# EAGLE design cpld_EPM3256_v3 (EAGLE 9.6.2)
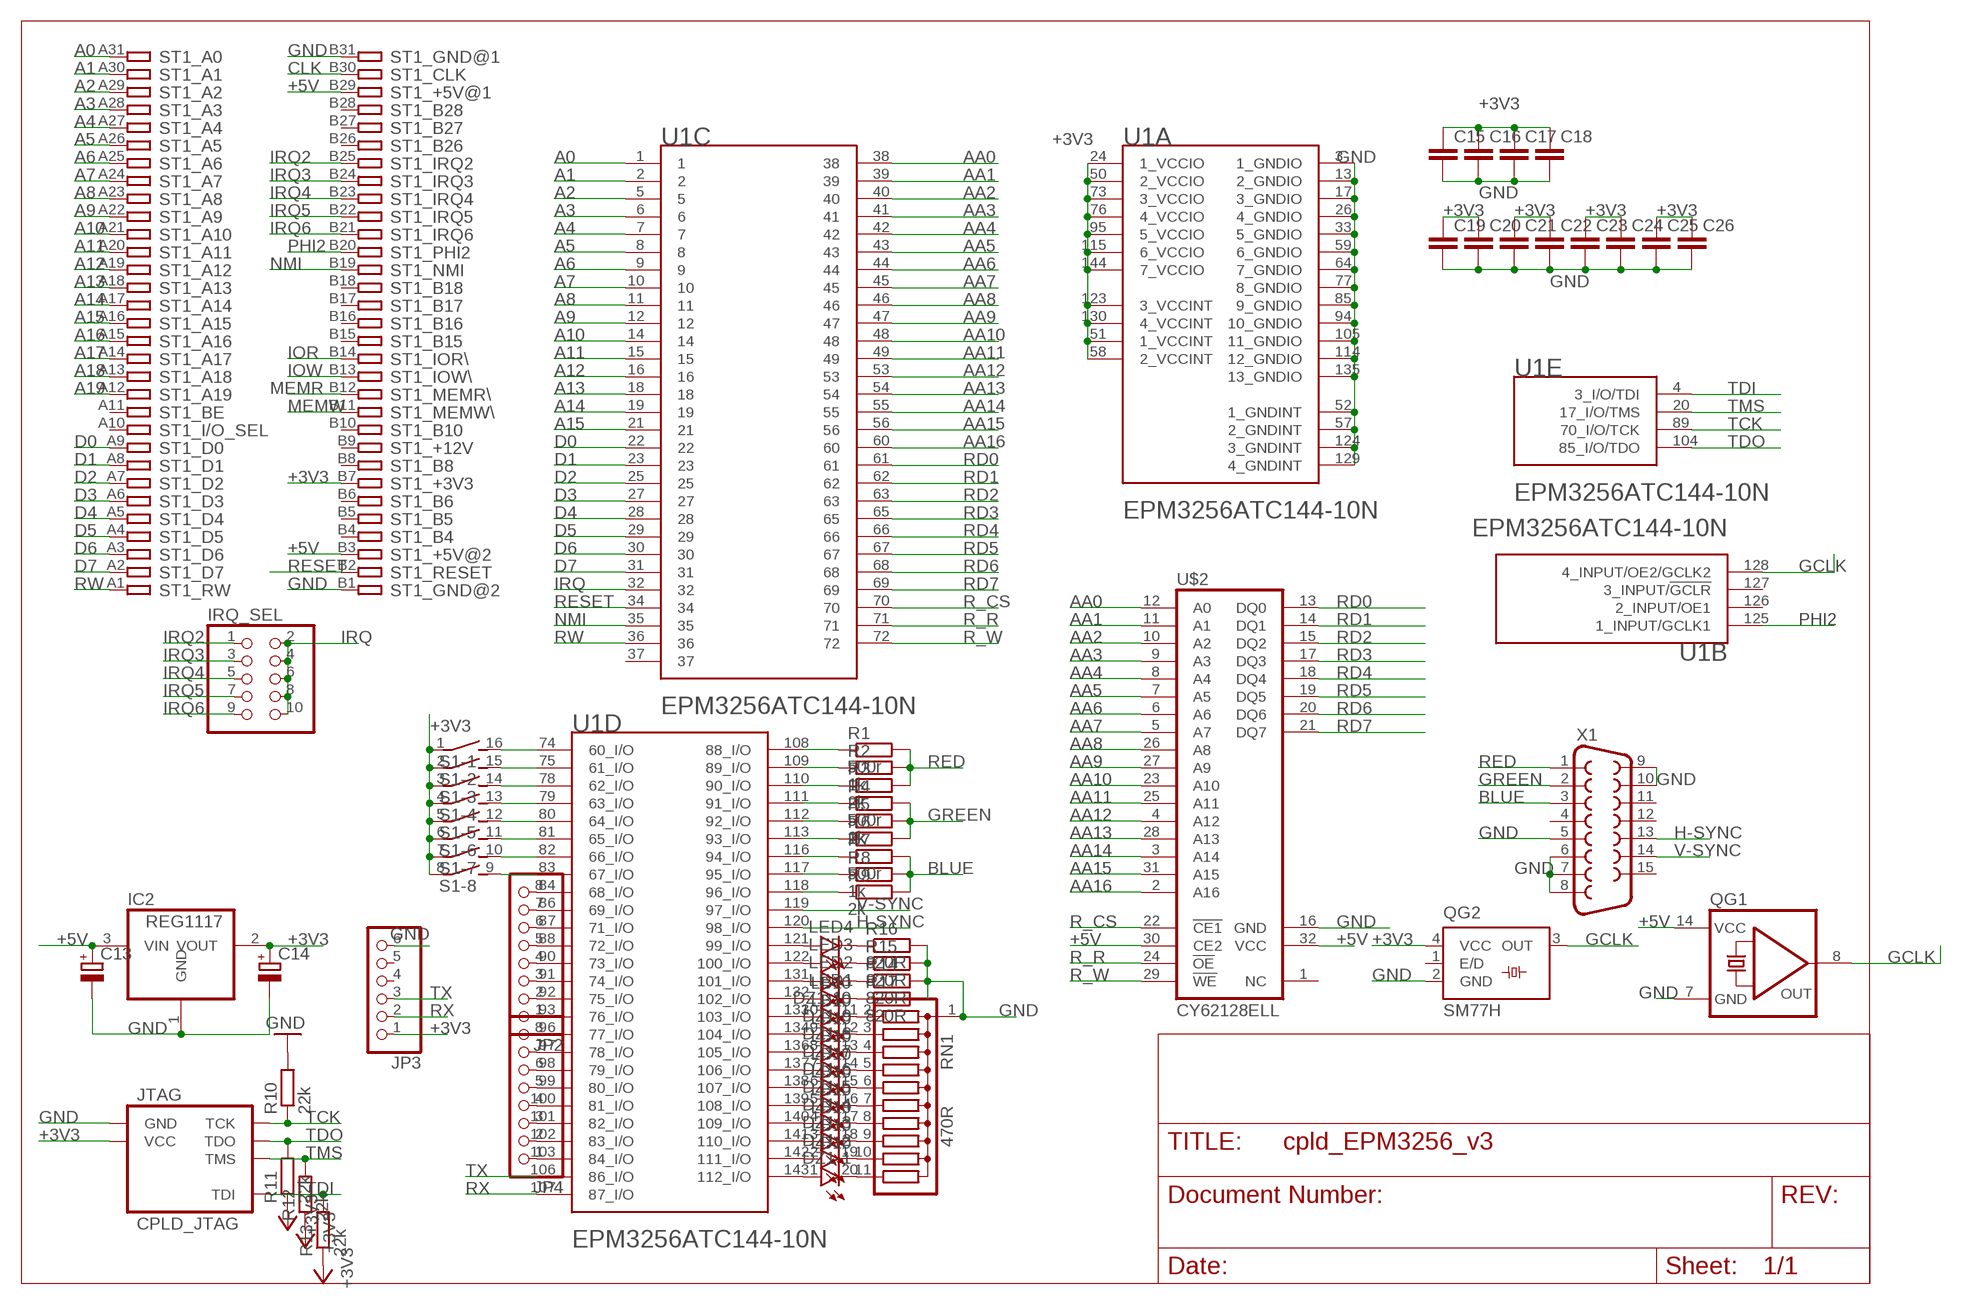
[diagram p0: schematic, sheet 1]

## Parts
C13  CPOL-EUE2.5-5  [E2,5-5]
C14  CPOL-EUE2.5-5  [E2,5-5]
C15  C-EU050-035X075  [C050-035X075]
C16  C-EU050-035X075  [C050-035X075]
C17  C-EU050-035X075  [C050-035X075]
C18  C-EU050-035X075  [C050-035X075]
C19  C-EU050-035X075  [C050-035X075]
C20  C-EU050-035X075  [C050-035X075]
C21  C-EU050-035X075  [C050-035X075]
C22  C-EU050-035X075  [C050-035X075]
C23  C-EU050-035X075  [C050-035X075]
C24  C-EU050-035X075  [C050-035X075]
C25  C-EU050-035X075  [C050-035X075]
C26  C-EU050-035X075  [C050-035X075]
DZ1  LB10  [LB10]
IC2  REG1117  [SOT223]
IRQ_SEL  PINHD-2X5  [2X05]
JP2  PINHD-1X8  [1X08]
JP3  PINHD-1X6/90  [1X06/90]
JP4  PINHD-1X8  [1X08]
JTAG  CPLD_JTAG  [2X05]
LED1  LED3MM  [LED3MM]
LED2  LED3MM  [LED3MM]
LED3  LED3MM  [LED3MM]
LED4  LED3MM  [LED3MM]
QG1  QG5860  [DIL14S]
QG2  SM77H  [SM77H]
R1  500r  R-EU_0204/2V  [0204V]
R2  1k  R-EU_0204/2V  [0204V]
R3  2k  R-EU_0204/2V  [0204V]
R4  500r  R-EU_0204/2V  [0204V]
R5  1k  R-EU_0204/2V  [0204V]
R6  2k  R-EU_0204/2V  [0204V]
R7  500r  R-EU_0204/2V  [0204V]
R8  1k  R-EU_0204/2V  [0204V]
R9  2k  R-EU_0204/2V  [0204V]
R10  22k  R-EU_0207/7  [0207/7]
R11  22k  R-EU_0207/7  [0207/7]
R12  22k  R-EU_0207/7  [0207/7]
R13  22k  R-EU_0207/7  [0207/7]
R14  820R  R-EU_0207/2V  [0207/2V]
R15  820R  R-EU_0207/2V  [0207/2V]
R16  820R  R-EU_0207/2V  [0207/2V]
R17  820R  R-EU_0207/2V  [0207/2V]
RN1  470R  G10R  [SIL11]
S1  DIP08S  [DIP08S]
ST1  IBM8BIT_ISA  [IBM8BIT]
U1  EPM3256ATC144  [TQFP144-BB]
U$2  CY62128ELL  [SOIC32]
X1  F15HDH  [HDF15H]

## Nets
74: S1.16 U1.74(D:60_I/O)
75: S1.15 U1.75(D:61_I/O)
78: S1.14 U1.78(D:62_I/O)
79: S1.13 U1.79(D:63_I/O)
80: S1.12 U1.80(D:64_I/O)
81: S1.11 U1.81(D:65_I/O)
82: S1.10 U1.82(D:66_I/O)
83: S1.9 U1.83(D:67_I/O)
84: JP2.8 U1.84(D:68_I/O)
86: JP2.7 U1.86(D:69_I/O)
87: JP2.6 U1.87(D:71_I/O)
88: JP2.5 U1.88(D:72_I/O)
90: JP2.4 U1.90(D:73_I/O)
91: JP2.3 U1.91(D:74_I/O)
92: JP2.2 U1.92(D:75_I/O)
93: JP2.1 U1.93(D:76_I/O)
96: JP4.8 U1.96(D:77_I/O)
97: JP4.7 U1.97(D:78_I/O)
98: JP4.6 U1.98(D:79_I/O)
99: JP4.5 U1.99(D:80_I/O)
100: JP4.4 U1.100(D:81_I/O)
101: JP4.3 U1.101(D:82_I/O)
102: JP4.2 U1.102(D:83_I/O)
103: JP4.1 U1.103(D:84_I/O)
121: LED4.A U1.121(D:99_I/O)
122: LED3.A U1.122(D:100_I/O)
131: LED2.A U1.131(D:101_I/O)
132: LED1.A U1.132(D:102_I/O)
133: DZ1.10(-10:A) U1.133(D:103_I/O)
134: DZ1.9(-9:A) U1.134(D:104_I/O)
136: DZ1.8(-8:A) U1.136(D:105_I/O)
137: DZ1.7(-7:A) U1.137(D:106_I/O)
138: DZ1.6(-6:A) U1.138(D:107_I/O)
139: DZ1.5(-5:A) U1.139(D:108_I/O)
140: DZ1.4(-4:A) U1.140(D:109_I/O)
141: DZ1.3(-3:A) U1.141(D:110_I/O)
142: DZ1.2(-2:A) U1.142(D:111_I/O)
143: DZ1.1(-1:A) U1.143(D:112_I/O)
+3V3: C14.+ C15.1 C16.1 C17.1 C18.1 C19.1 C20.1 C21.1 C22.1 C23.1 C24.1 C25.1 C26.1 IC2.2(VOUT) JP3.1 JTAG.4(VCC) QG2.4(VCC) R11.1 R12.1 R13.1 S1.1 S1.2 S1.3 S1.4 S1.5 S1.6 S1.7 S1.8 ST1.B7 U1.24(A:1_VCCIO) U1.50(A:2_VCCIO) U1.51(A:1_VCCINT) U1.58(A:2_VCCINT) U1.73(A:3_VCCIO) U1.76(A:4_VCCIO) U1.95(A:5_VCCIO) U1.115(A:6_VCCIO) U1.123(A:3_VCCINT) U1.130(A:4_VCCINT) U1.144(A:7_VCCIO)
+5V: C13.+ IC2.3(VIN) QG1.14(VCC) ST1.B3 ST1.B29 U$2.30(CE2) U$2.32(VCC)
A0: ST1.A31 U1.1
A1: ST1.A30 U1.2
A2: ST1.A29 U1.5
A3: ST1.A28 U1.6
A4: ST1.A27 U1.7
A5: ST1.A26 U1.8
A6: ST1.A25 U1.9
A7: ST1.A24 U1.10
A8: ST1.A23 U1.11
A9: ST1.A22 U1.12
A10: ST1.A21 U1.14
A11: ST1.A20 U1.15
A12: ST1.A19 U1.16
A13: ST1.A18 U1.18
A14: ST1.A17 U1.19
A15: ST1.A16 U1.21
A16: ST1.A15
A17: ST1.A14
A18: ST1.A13
A19: ST1.A12
AA0: U1.38 U$2.12(A0)
AA1: U1.39 U$2.11(A1)
AA2: U1.40 U$2.10(A2)
AA3: U1.41 U$2.9(A3)
AA4: U1.42 U$2.8(A4)
AA5: U1.43 U$2.7(A5)
AA6: U1.44 U$2.6(A6)
AA7: U1.45 U$2.5(A7)
AA8: U1.46 U$2.26(A8)
AA9: U1.47 U$2.27(A9)
AA10: U1.48 U$2.23(A10)
AA11: U1.49 U$2.25(A11)
AA12: U1.53 U$2.4(A12)
AA13: U1.54 U$2.28(A13)
AA14: U1.55 U$2.3(A14)
AA15: U1.56 U$2.31(A15)
AA16: U1.60 U$2.2(A16)
B1: R8.1 U1.117(D:95_I/O)
B2: R9.1 U1.118(D:96_I/O)
B5: R7.1 U1.116(D:94_I/O)
BLUE: R7.2 R8.2 R9.2 X1.3
CLK: ST1.B30
D0: ST1.A9 U1.22
D1: ST1.A8 U1.23
D2: ST1.A7 U1.25
D3: ST1.A6 U1.27
D4: ST1.A5 U1.28
D5: ST1.A4 U1.29
D6: ST1.A3 U1.30
D7: ST1.A2 U1.31
G1: R5.1 U1.112(D:92_I/O)
G2: R6.1 U1.113(D:93_I/O)
G5: R4.1 U1.111(D:91_I/O)
GCLK: QG1.8(OUT) QG2.3(OUT) U1.128(B:4_INPUT/OE2/GCLK2)
GND [power]: C13.- C14.- C15.2 C16.2 C17.2 C18.2 C19.2 C20.2 C21.2 C22.2 C23.2 C24.2 C25.2 C26.2 IC2.1(GND) JP3.6 JTAG.2(GND) JTAG.6(GND) JTAG.7(GND) JTAG.8(GND) JTAG.10(GND) QG1.7(GND) QG2.2(GND) R10.2 R14.2 R15.2 R16.2 R17.2 RN1.1 ST1.B1 ST1.B31 U1.3(A:1_GNDIO) U1.13(A:2_GNDIO) U1.17(A:3_GNDIO) U1.26(A:4_GNDIO) U1.33(A:5_GNDIO) U1.52(A:1_GNDINT) U1.57(A:2_GNDINT) U1.59(A:6_GNDIO) U1.64(A:7_GNDIO) U1.77(A:8_GNDIO) U1.85(A:9_GNDIO) U1.94(A:10_GNDIO) U1.105(A:11_GNDIO) U1.114(A:12_GNDIO) U1.124(A:3_GNDINT) U1.129(A:4_GNDINT) U1.135(A:13_GNDIO) U$2.16(GND) X1.5 X1.6 X1.7 X1.8 X1.9 X1.10
GREEN: R4.2 R5.2 R6.2 X1.2
H-SYNC: U1.120(D:98_I/O) X1.13
IOR: ST1.B14
IOW: ST1.B13
IRQ: IRQ_SEL.2 IRQ_SEL.4 IRQ_SEL.6 IRQ_SEL.8 IRQ_SEL.10 U1.32
IRQ2: IRQ_SEL.1 ST1.B25
IRQ3: IRQ_SEL.3 ST1.B24
IRQ4: IRQ_SEL.5 ST1.B23
IRQ5: IRQ_SEL.7 ST1.B22
IRQ6: IRQ_SEL.9 ST1.B21
MEMR: ST1.B12
MEMW: ST1.B11
N$5: LED2.K(C) R14.1
N$6: LED3.K(C) R15.1
N$7: LED4.K(C) R16.1
N$8: LED1.K(C) R17.1
N$23: DZ1.20(-1:C) RN1.11
N$24: DZ1.19(-2:C) RN1.10
N$25: DZ1.18(-3:C) RN1.9
N$26: DZ1.17(-4:C) RN1.8
N$27: DZ1.16(-5:C) RN1.7
N$28: DZ1.15(-6:C) RN1.6
N$29: DZ1.14(-7:C) RN1.5
N$30: DZ1.13(-8:C) RN1.4
N$31: DZ1.12(-9:C) RN1.3
N$32: DZ1.11(-10:C) RN1.2
NMI: ST1.B19 U1.35
PHI2: ST1.B20 U1.125(B:1_INPUT/GCLK1)
R1: R2.1 U1.109(D:89_I/O)
R2: R3.1 U1.110(D:90_I/O)
R5: R1.1 U1.108(D:88_I/O)
R_CS: U1.70 U$2.22(!CE1)
R_R: U1.71 U$2.24(!OE)
R_W: U1.72 U$2.29(!WE)
RD0: U1.61 U$2.13(DQ0)
RD1: U1.62 U$2.14(DQ1)
RD2: U1.63 U$2.15(DQ2)
RD3: U1.65 U$2.17(DQ3)
RD4: U1.66 U$2.18(DQ4)
RD5: U1.67 U$2.19(DQ5)
RD6: U1.68 U$2.20(DQ6)
RD7: U1.69 U$2.21(DQ7)
RED: R1.2 R2.2 R3.2 X1.1
RESET: ST1.B2 U1.34
RW: ST1.A1 U1.36
RX: JP3.2 U1.107(D:87_I/O)
TCK: JTAG.1(TCK) R10.1 U1.89(E:70_I/O/TCK)
TDI: JTAG.9(TDI) R13.2 U1.4(E:3_I/O/TDI)
TDO: JTAG.3(TDO) R11.2 U1.104(E:85_I/O/TDO)
TMS: JTAG.5(TMS) R12.2 U1.20(E:17_I/O/TMS)
TX: JP3.3 U1.106(D:86_I/O)
V-SYNC: U1.119(D:97_I/O) X1.14
Unconnected: JP3.4 JP3.5 QG2.1(E/D) ST1.A10 ST1.A11 ST1.B4 ST1.B5 ST1.B6 ST1.B8 ST1.B9 ST1.B10 ST1.B15 ST1.B16 ST1.B17 ST1.B18 ST1.B26 ST1.B27 ST1.B28 U1.37 U1.126(B:2_INPUT/OE1) U1.127(B:3_INPUT/!GCLR!) U$2.1(NC) X1.4 X1.11 X1.12 X1.15

## Library data of the parts
C13 C14 = rcl:CPOL-EU: POLARIZED CAPACITOR, European symbol; SPICEPREFIX: C
C15-C26 = rcl:C-EU: CAPACITOR, European symbol; SPICEPREFIX: C
DZ1 = led:LB10: LED BLOCK 10-LED bar graph, DIL, Siemens
IC2 = burr-brown:REG1117: 800mA and 1A Low Dropout (LDO) Positive Regulator 1.8V, 2.5V, 2.85V, 3.3V, 5V, and Adj; MPN: REG1117; OC_FARNELL: 1097566; OC_NEWARK: 14P6981
IRQ_SEL = pinhead:PINHD-2X5: PIN HEADER
JP2 JP4 = pinhead:PINHD-1X8: PIN HEADER
JP3 = pinhead:PINHD-1X6: PIN HEADER
JTAG = TiRoRiN_Libs:CPLD_JTAG
LED1-LED4 = led:LED: LED OSRAM: - CHIPLED LG R971, LG N971, LY N971, LG Q971, LY Q971, LO R971, LY R971 LH N974, LH R974 LS Q976, LO Q976, LY Q976 LO Q996 - Hyper CHIPLED LW Q18S LB Q993, LB Q99A, LB R99A - SideLED LS A670, LO A670, LY A670, LG A670, LP A670 LB A673, LV A673, LT A673, LW A673 LH A674 LY A675 LS A676, LA A676, LO A676, LY A676, LW A676 LS A679, LY A679, LG A679 - Hyper Micro SIDELED® LS Y876, LA Y876, LO Y876, LY Y876 LT Y87S - SmartLED LW L88C, LW L88S LB L89C, LB L89S, LG L890 LS L89K, LO L89K, LY L89K LS L896, LA L896, LO L896, LY L896 - TOPLED LS T670, LO T670, LY T670, LG T670, LP T670 LSG T670, LSP T670, LSY T670, LOP T670, LYG T670 LG T671, LOG T671, LSG T671 LB T673, LV T673, LT T673, LW T673 LH T674 LS T676, LA T676, LO T676, LY T676, LB T676, LH T676, LSB T676, LW T676 LB T67C, LV T67C, LT T67C, LS T67K, LO T67K, LY T67K, LW E67C LS E67B, LA E67B, LO E67B, LY E67B, LB E67C, LV E67C, LT E67C LW T67C LS T679, LY T679, LG T679 LS T770, LO T770, LY T770, LG T770, LP T770 LB T773, LV T773, LT T773, LW T773 LH T774 LS E675, LA E675, LY E675, LS T675 LS T776, LA T776, LO T776, LY T776, LB T776 LHGB T686 LT T68C, LB T68C - Hyper Mini TOPLED® LB M676 - Mini TOPLED Santana® LG M470 LS M47K, LO M47K, LY M47K Source: http://www.osram.convergy.de LUXEON: - LUMILED® LXK2-PW12-R00, LXK2-PW12-S00, LXK2-PW14-U00, LXK2-PW14-V00 LXK2-PM12-R00, LXK2-PM12-S00, LXK2-PM14-U00 LXK2-PE12-Q00, LXK2-PE12-R00, LXK2-PE12-S00, LXK2-PE14-T00, LXK2-PE14-U00 LXK2-PB12-K00, LXK2-PB12-L00, LXK2-PB12-M00, LXK2-PB14-N00, LXK2-PB14-P00, LXK2-PB14-Q00 LXK2-PR12-L00, LXK2-PR12-M00, LXK2-PR14-Q00, LXK2-PR14-R00 LXK2-PD12-Q00, LXK2-PD12-R00, LXK2-PD12-S00 LXK2-PH12-R00, LXK2-PH12-S00 LXK2-PL12-P00, LXK2-PL12-Q00, LXK2-PL12-R00 Source: www.luxeon.com KINGBRIGHT: KA-3528ASYC Source: www.kingbright.com
QG1 = crystal:QG5860: CRYSTAL RESONATOR; OC_FARNELL: unknown; OC_NEWARK: unknown
QG2 = crystal:SM77H: 3.3V CMOS Clock Oscillator Source: www.pletronics.com .. sm77h%203.3v.pdf; OC_FARNELL: unknown; OC_NEWARK: unknown
R1-R17 = rcl:R-EU_: RESISTOR, European symbol; SPICEPREFIX: R
RN1 = resistor-sil:G10R: SIL RESISTOR; OC_FARNELL: unknown; OC_NEWARK: unknown
S1 = switch-dil:DIP08S: DIL/CODE SWITCH; OC_FARNELL: unknown; OC_NEWARK: unknown
ST1 = TiRoRiN_Libs:IBM8BIT_ISA: 8-bit CARD IBM/PC-AT
U1 = TiRoRiN_Libs:EPM3256ATC144: Programmable Logic Device Family
U$2 = TiRoRiN_Libs:CY62128ELL
X1 = con-subd:F15: SUB-D; OC_FARNELL: unknown; OC_NEWARK: unknown

## Net classes
0 default: width 0.152 mm, drill 0.66 mm, clearance 0.254 mm
1 power: width 0.508 mm, drill 0.66 mm, clearance 0.381 mm to class 0, clearance 0.381 mm
2 data: width 0.381 mm, drill 0.66 mm, clearance 0.254 mm to class 0, clearance 0.254 mm to class 1, clearance 0.254 mm

## Board
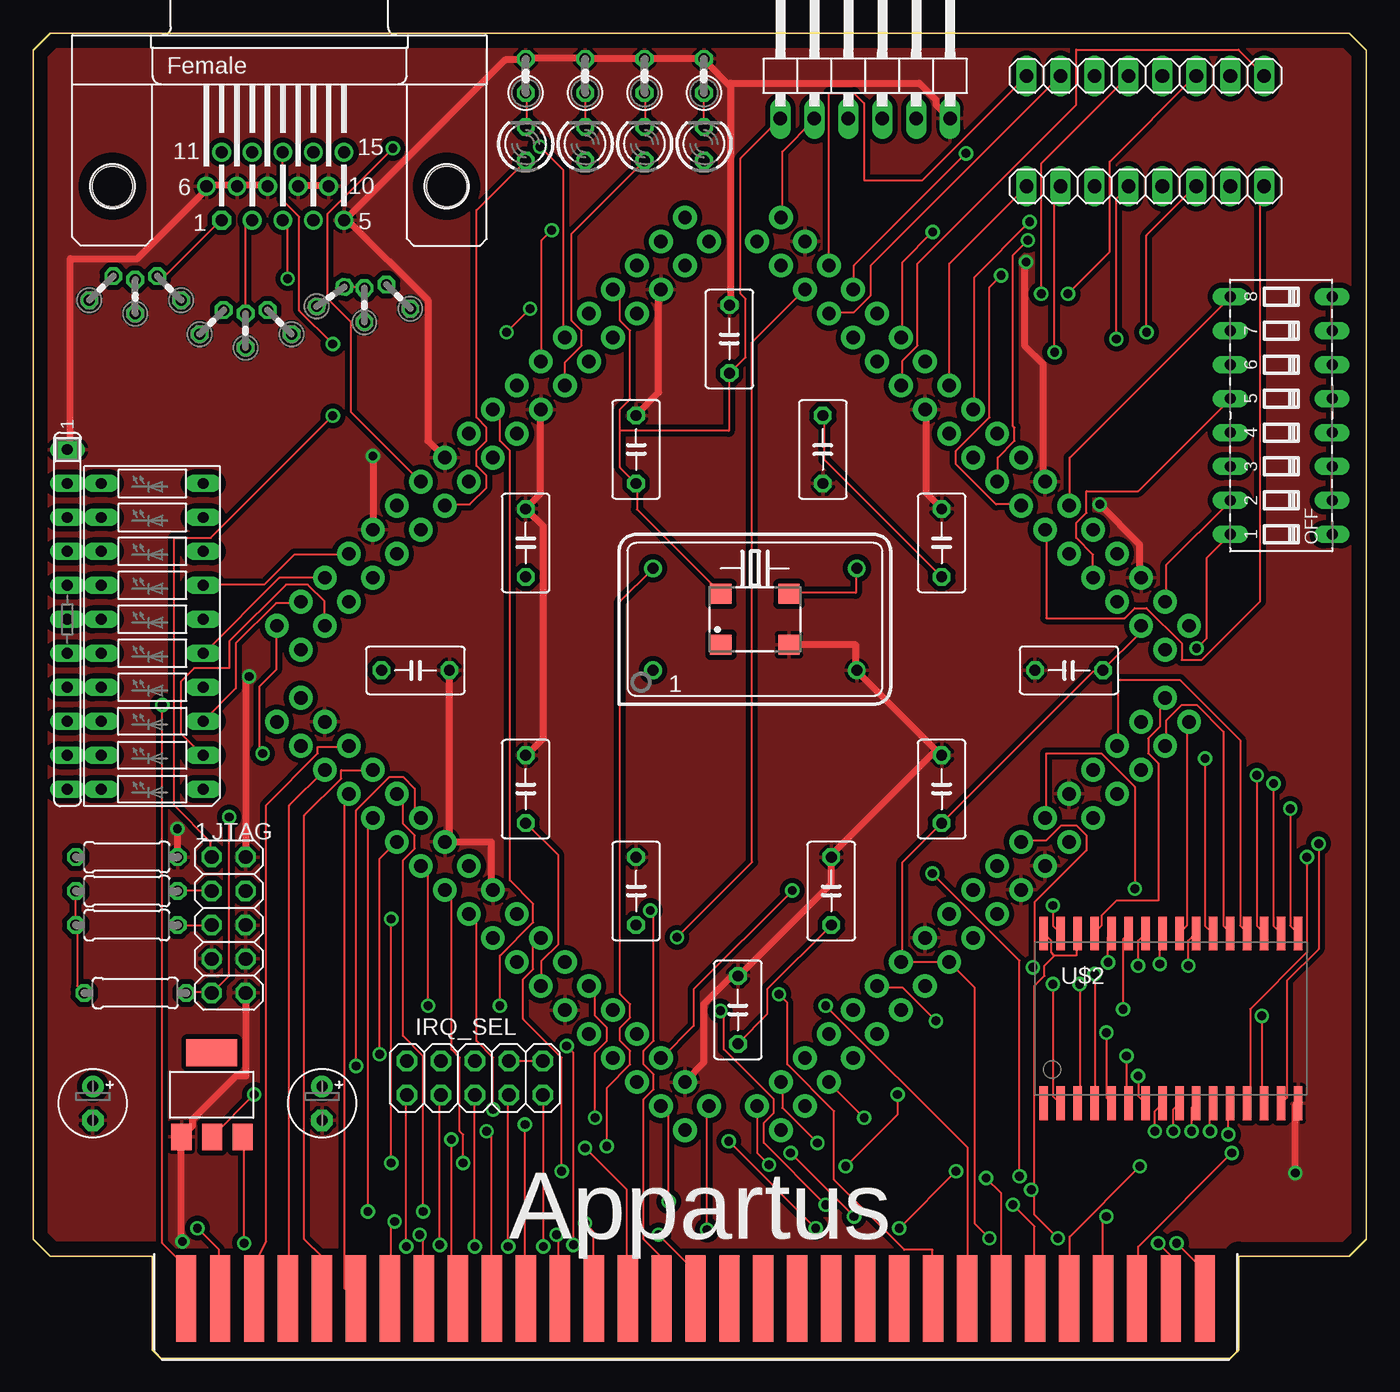
[diagram p1: board, top side]
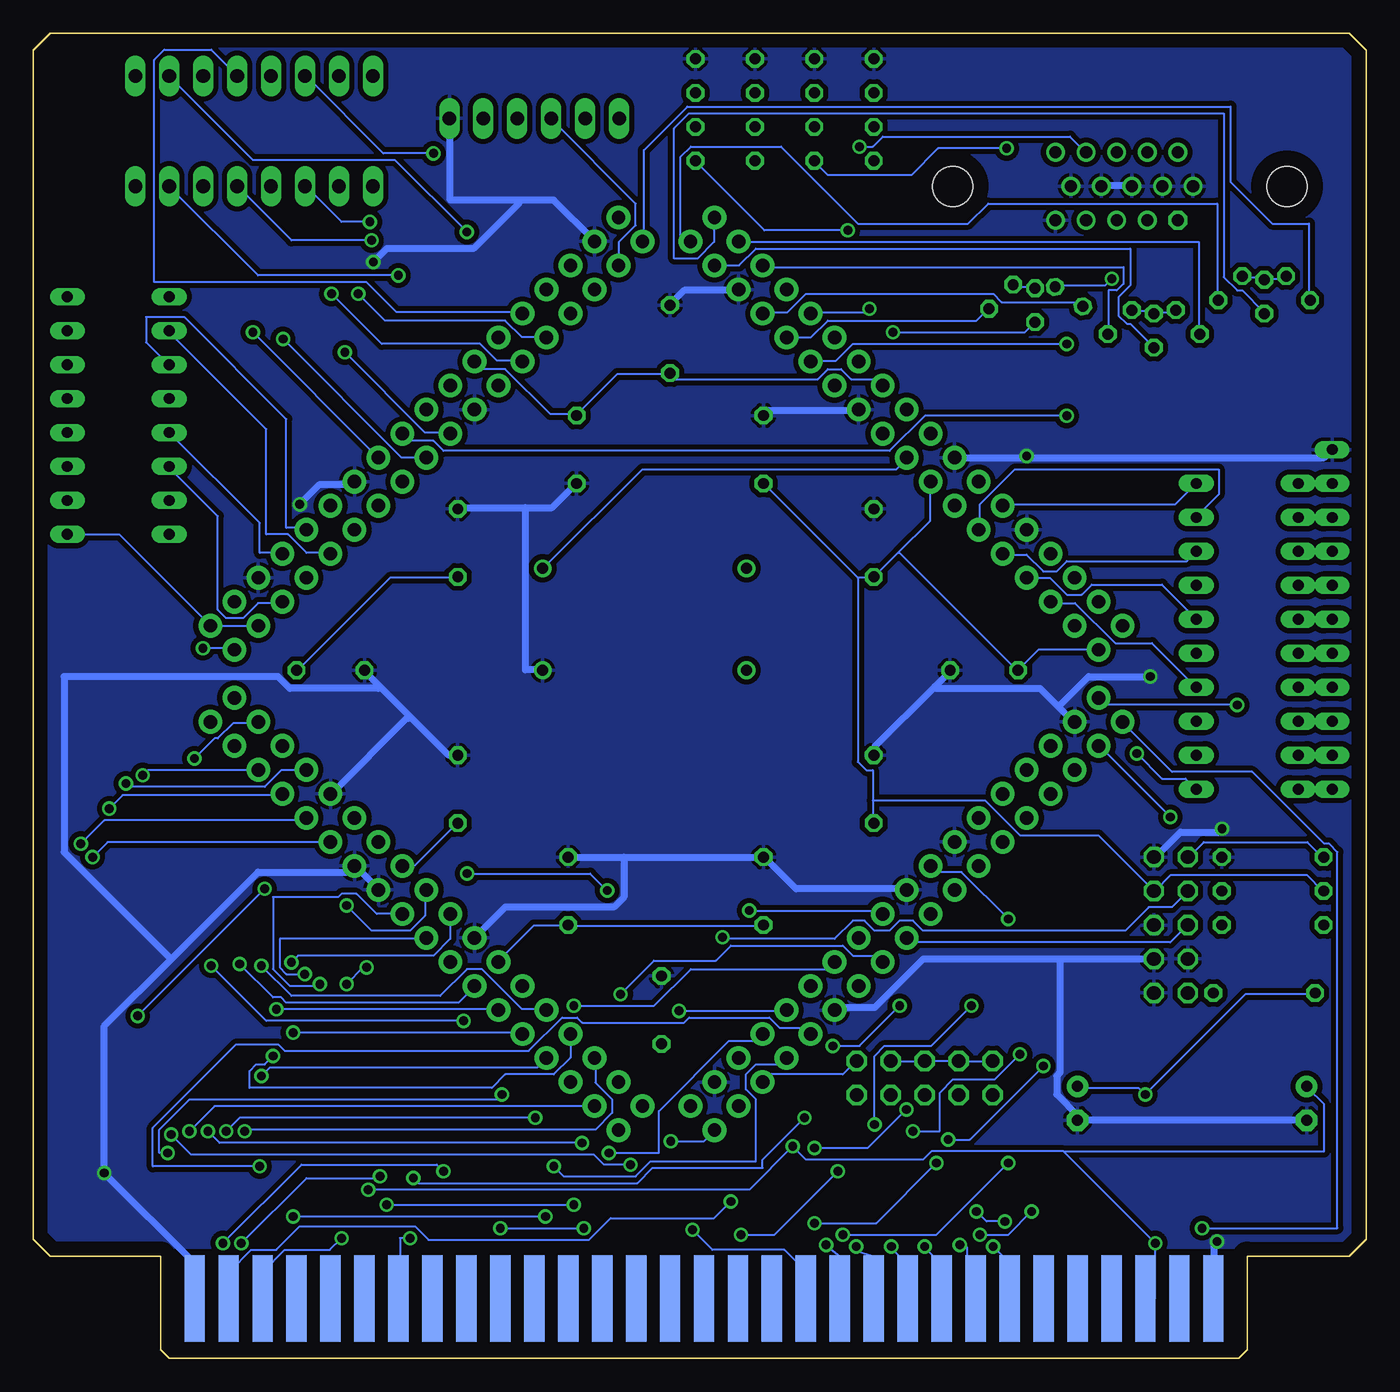
[diagram p2: board, bottom side, seen from below]

Size 99.69 x 99.06 mm. Coordinates in mm from the lower left corner, seen from the top.
Copper layers (1*16): Top 0.035mm / dielectric 1.5mm / Bottom 0.035mm
Design rules "default": minimum track width 6mil, minimum drill 0.35mm, track to track 6mil, track to pad 6mil, pad to pad 6mil, via to via 6mil, smd to smd 6mil, copper to edge 40mil, drill to drill 6mil, minimum pad ring 10mil, minimum via ring 8mil, stop-mask expansion 4mil, vias tented up to drill 0mil, thermal gap 10mil

### Footprints (pad centres in the part's own frame; a part is rotated, then mirrored left to right if it is on the bottom)
E2,5-5 = drill 0.813 pad 1.6: + -1.27,0 | drill 0.813 pad 1.6 octagon: - 1.27,0
C050-035X075 = drill 0.813 octagon: 1 -2.54,0; 2 2.54,0
LB10 = drill 0.813 long: 1 -11.43,-3.81; 2 -8.89,-3.81; 3 -6.35,-3.81; 4 -3.81,-3.81; 5 -1.27,-3.81; 6 1.27,-3.81; 7 3.81,-3.81; 8 6.35,-3.81; 9 8.89,-3.81; 10 11.43,-3.81; 11 11.43,3.81; 12 8.89,3.81; 13 6.35,3.81; 14 3.81,3.81; 15 1.27,3.81; 16 -1.27,3.81; 17 -3.81,3.81; 18 -6.35,3.81; 19 -8.89,3.81; 20 -11.43,3.81
SOT223 = smd 1.499 x 2.007: 1 -2.261,-3.15; 2 0.025,-3.15; 3 2.311,-3.15 | smd 3.81 x 2.007: 4 0,3.15
2X05 = drill 1.016 octagon: 1 -5.08,-1.27; 2 -5.08,1.27; 3 -2.54,-1.27; 4 -2.54,1.27; 5 0,-1.27; 6 0,1.27; 7 2.54,-1.27; 8 2.54,1.27; 9 5.08,-1.27; 10 5.08,1.27
1X08 = drill 1.016 long: 1 -8.89,0; 2 -6.35,0; 3 -3.81,0; 4 -1.27,0; 5 1.27,0; 6 3.81,0; 7 6.35,0; 8 8.89,0
1X06/90 = drill 1.016 long: 1 -6.35,-3.81; 2 -3.81,-3.81; 3 -1.27,-3.81; 4 1.27,-3.81; 5 3.81,-3.81; 6 6.35,-3.81
LED3MM = drill 0.813 octagon: A -1.27,0; K 1.27,0
DIL14S = drill 0.813: 1 -7.62,-3.81; 7 7.62,-3.81; 8 7.62,3.81; 14 -7.62,3.81
SM77H = smd 1.6 x 1.5: 1 -2.55,-1.9; 2 2.55,-1.9; 3 2.55,1.9; 4 -2.55,1.9
0204V = drill 0.813 octagon: 1 -1.27,0; 2 1.27,0
0207/7 = drill 0.813 octagon: 1 -3.81,0; 2 3.81,0
0207/2V = drill 0.813 octagon: 1 -1.27,0; 2 1.27,0
SIL11 = drill 0.813 long: 1 -12.7,0; 2 -10.16,0; 3 -7.62,0; 4 -5.08,0; 5 -2.54,0; 6 0,0; 7 2.54,0; 8 5.08,0; 9 7.62,0; 10 10.16,0; 11 12.7,0
DIP08S = drill 0.813 long: 1 -8.89,-3.81; 2 -6.35,-3.81; 3 -3.81,-3.81; 4 -1.27,-3.81; 5 1.27,-3.81; 6 3.81,-3.81; 7 6.35,-3.81; 8 8.89,-3.81; 9 8.89,3.81; 10 6.35,3.81; 11 3.81,3.81; 12 1.27,3.81; 13 -1.27,3.81; 14 -3.81,3.81; 15 -6.35,3.81; 16 -8.89,3.81
IBM8BIT = smd 1.524 x 6.477: A1 38.1,-44.45; A2 35.56,-44.45; A3 33.02,-44.45; A4 30.48,-44.45; A5 27.94,-44.45; A6 25.4,-44.45; A7 22.86,-44.45; A8 20.32,-44.45; A9 17.78,-44.45; A10 15.24,-44.45; A11 12.7,-44.45; A12 10.16,-44.45; A13 7.62,-44.45; A14 5.08,-44.45; A15 2.54,-44.45; A16 0,-44.45; A17 -2.54,-44.45; A18 -5.08,-44.45; A19 -7.62,-44.45; A20 -10.16,-44.45; A21 -12.7,-44.45; A22 -15.24,-44.45; A23 -17.78,-44.45; A24 -20.32,-44.45; A25 -22.86,-44.45; A26 -25.4,-44.45; A27 -27.94,-44.45; A28 -30.48,-44.45; A29 -33.02,-44.45; A30 -35.56,-44.45; A31 -38.1,-44.45 | smd 1.524 x 6.477 bottom: B1 38.1,-44.45; B2 35.56,-44.45; B3 33.02,-44.45; B4 30.48,-44.45; B5 27.94,-44.45; B6 25.4,-44.45; B7 22.86,-44.45; B8 20.32,-44.45; B9 17.78,-44.45; B10 15.24,-44.45; B11 12.7,-44.45; B12 10.16,-44.45; B13 7.62,-44.45; B14 5.08,-44.45; B15 2.54,-44.45; B16 0,-44.45; B17 -2.54,-44.45; B18 -5.08,-44.45; B19 -7.62,-44.45; B20 -10.16,-44.45; B21 -12.7,-44.45; B22 -15.24,-44.45; B23 -17.78,-44.45; B24 -20.32,-44.45; B25 -22.86,-44.45; B26 -25.4,-44.45; B27 -27.94,-44.45; B28 -30.48,-44.45; B29 -33.02,-44.45; B30 -35.56,-44.45; B31 -38.1,-44.45
TQFP144-BB = drill 1 pad 1.778: 1 -24.13,20.32; 2 -26.67,20.32; 3 -24.13,17.78; 4 -26.67,17.78; 5 -24.13,15.24; 6 -26.67,15.24; 7 -24.13,12.7; 8 -26.67,12.7; 9 -24.13,10.16; 10 -26.67,10.16; 11 -24.13,7.62; 12 -26.67,7.62; 13 -24.13,5.08; 14 -26.67,5.08; 15 -24.13,2.54; 16 -26.67,2.54; 17 -24.13,0; 18 -26.67,0; 19 -24.13,-2.54; 20 -26.67,-2.54; 21 -24.13,-5.08; 22 -26.67,-5.08; 23 -24.13,-7.62; 24 -26.67,-7.62; 25 -24.13,-10.16; 26 -26.67,-10.16; 27 -24.13,-12.7; 28 -26.67,-12.7; 29 -24.13,-15.24; 30 -26.67,-15.24; 31 -24.13,-17.78; 32 -26.67,-17.78; 33 -24.13,-20.32; 34 -26.67,-20.32; 35 -24.13,-22.86; 36 -26.67,-22.86; 37 -21.59,-27.94; 38 -21.59,-25.4; 39 -19.05,-27.94; 40 -19.05,-25.4; 41 -16.51,-27.94; 42 -16.51,-25.4; 43 -13.97,-27.94; 44 -13.97,-25.4; 45 -11.43,-27.94; 46 -11.43,-25.4; 47 -8.89,-27.94; 48 -8.89,-25.4; 49 -6.35,-27.94; 50 -6.35,-25.4; 51 -3.81,-27.94; 52 -3.81,-25.4; 53 -1.27,-27.94; 54 -1.27,-25.4; 55 1.27,-27.94; 56 1.27,-25.4; 57 3.81,-27.94; 58 3.81,-25.4; 59 6.35,-27.94; 60 6.35,-25.4; 61 8.89,-27.94; 62 8.89,-25.4; 63 11.43,-27.94; 64 11.43,-25.4; 65 13.97,-27.94; 66 13.97,-25.4; 67 16.51,-27.94; 68 16.51,-25.4; 69 19.05,-27.94; 70 19.05,-25.4; 71 21.59,-27.94; 72 21.59,-25.4; 73 26.67,-22.86; 74 24.13,-22.86; 75 26.67,-20.32; 76 24.13,-20.32; 77 26.67,-17.78; 78 24.13,-17.78; 79 26.67,-15.24; 80 24.13,-15.24; 81 26.67,-12.7; 82 24.13,-12.7; 83 26.67,-10.16; 84 24.13,-10.16; 85 26.67,-7.62; 86 24.13,-7.62; 87 26.67,-5.08; 88 24.13,-5.08; 89 26.67,-2.54; 90 24.13,-2.54; 91 26.67,0; 92 24.13,0; 93 26.67,2.54; 94 24.13,2.54; 95 26.67,5.08; 96 24.13,5.08; 97 26.67,7.62; 98 24.13,7.62; 99 26.67,10.16; 100 24.13,10.16; 101 26.67,12.7; 102 24.13,12.7; 103 26.67,15.24; 104 24.13,15.24; 105 26.67,17.78; 106 24.13,17.78; 107 26.67,20.32; 108 24.13,20.32; 109 21.59,25.4; 110 21.59,22.86; 111 19.05,25.4; 112 19.05,22.86; 113 16.51,25.4; 114 16.51,22.86; 115 13.97,25.4; 116 13.97,22.86; 117 11.43,25.4; 118 11.43,22.86; 119 8.89,25.4; 120 8.89,22.86; 121 6.35,25.4; 122 6.35,22.86; 123 3.81,25.4; 124 3.81,22.86; 125 1.27,25.4; 126 1.27,22.86; 127 -1.27,25.4; 128 -1.27,22.86; 129 -3.81,25.4; 130 -3.81,22.86; 131 -6.35,25.4; 132 -6.35,22.86; 133 -8.89,25.4; 134 -8.89,22.86; 135 -11.43,25.4; 136 -11.43,22.86; 137 -13.97,25.4; 138 -13.97,22.86; 139 -16.51,25.4; 140 -16.51,22.86; 141 -19.05,25.4; 142 -19.05,22.86; 143 -21.59,25.4; 144 -21.59,22.86
SOIC32 = smd 0.635 x 2.54: 1 -9.525,-6.35; 2 -8.255,-6.35; 3 -6.985,-6.35; 4 -5.715,-6.35; 5 -4.445,-6.35; 6 -3.175,-6.35; 7 -1.905,-6.35; 8 -0.635,-6.35; 9 0.635,-6.35; 10 1.905,-6.35; 11 3.175,-6.35; 12 4.445,-6.35; 13 5.715,-6.35; 14 6.985,-6.35; 15 8.255,-6.35; 16 9.525,-6.35; 17 9.525,6.35; 18 8.255,6.35; 19 6.985,6.35; 20 5.715,6.35; 21 4.445,6.35; 22 3.175,6.35; 23 1.905,6.35; 24 0.635,6.35; 25 -0.635,6.35; 26 -1.905,6.35; 27 -3.175,6.35; 28 -4.445,6.35; 29 -5.715,6.35; 30 -6.985,6.35; 31 -8.255,6.35; 32 -9.525,6.35
HDF15H = drill 0.9 octagon: 1 4.329,2.54 | drill 0.9: 2 2.043,2.54; 3 -0.243,2.54; 4 -2.529,2.54; 5 -4.815,2.54; 6 5.472,0; 7 3.186,0; 8 0.9,0; 9 -1.386,0; 10 -3.672,0; 11 4.329,-2.54; 12 2.043,-2.54; 13 -0.243,-2.54; 14 -2.529,-2.54; 15 -4.815,-2.54 | hole 3: -12.5,0; 12.5,0

### Placement (x,y rotation side)
C13  4.45,19.05 270 top
C14  21.59,19.05 270 top
C15  28.58,51.44 0 top
C16  45.09,34.93 90 top
C17  52.71,26.04 90 top
C18  59.69,34.93 90 top
C19  67.94,60.96 90 top
C20  59.05,67.94 270 top
C21  52.07,76.2 90 top
C22  45.09,67.94 90 top
C23  36.83,60.96 90 top
C24  36.83,42.55 90 top
C25  67.94,42.55 90 top
C26  77.47,51.44 180 top
DZ1  8.89,53.98 90 top
IC2  13.34,19.69 0 top
IRQ_SEL  33.02,20.96 0 top
JP2  83.19,87.63 0 top
JP3  62.23,96.52 0 top
JP4  83.19,95.89 0 top
JTAG  14.61,32.39 270 top
LED1  36.83,90.81 90 top
LED2  41.28,90.81 90 top
LED3  45.72,90.81 90 top
LED4  50.17,90.81 90 top
QG1  53.98,55.25 0 top
QG2  53.98,55.25 0 top
R1  5.08,80.01 45 top
R2  7.62,79.38 90 top
R3  10.16,80.01 135 top
R4  13.34,77.47 45 top
R5  15.88,76.84 90 top
R6  18.42,77.47 135 top
R7  22.23,79.38 35 top
R8  24.77,78.74 90 top
R9  27.31,79.38 135 top
R10  6.99,37.47 0 top
R11  6.99,34.93 0 top
R12  6.99,32.39 0 top
R13  7.62,27.31 0 top
R14  41.28,95.89 90 top
R15  45.72,95.89 90 top
R16  50.17,95.89 90 top
R17  36.83,95.89 90 top
RN1  2.54,55.25 270 top
S1  93.34,70.48 90 top
ST1  49.53,48.9 0 top
U1  51.44,52.07 45 top
U$2  85.09,25.4 0 top
X1  18.42,87.63 180 top

### Tracks (layer width: path | path; a pad name or v marks a point on that pad's centre or on a via)
74  (via drill 0.66)
  Top 0.152: v87.02,53.09 87.77,53.84 87.77,59.84 89.52,61.59 S1.16
  Bottom 0.152: v87.02,53.09 84.77,53.09 U1.74
75
  Top 0.152: S1.15 89.52,64.09 84.77,59.34 84.77,56.59 U1.75
78
  Bottom 0.152: S1.14 89.52,66.59 85.9,62.97 85.9,55.97 85.27,55.34 84.02,55.34 82.9,56.47 81.15,56.47 U1.78
79
  Bottom 0.152: S1.13 89.52,69.22 82.77,62.47 82.77,60.22 81.15,60.22 U1.79
80
  Top 0.152: S1.12 89.52,71.72 82.65,64.84 78.77,64.84 78.77,63.22 78.02,62.47 78.02,61.34 79.27,60.09 79.27,58.47 U1.80
81
  Bottom 0.152: S1.11 89.65,74.34 91.27,75.97 91.27,77.84 88.4,77.84 80.77,70.22 80.77,62.09 79.52,62.09 79.4,61.97 U1.81
82
  Bottom 0.152: S1.10 89.52,76.72 82.27,69.47 82.27,61.59 80.65,61.59 79.27,60.22 77.52,60.22 U1.82
83
  Top 0.152: S1.9 89.52,79.34 77.52,67.34 77.52,63.84 U1.83
84
  Top 0.152: JP2.8 92.02,87.59 91.77,87.34 91.77,56.59 87.4,52.22 85.9,52.22 85.9,53.47 83.27,56.09 82.4,56.09 81.65,55.34 75.77,55.34 75.77,61.84 U1.84
86  (via drill 0.66)
  Top 0.152: v72.4,80.97 71.52,80.09 71.52,70.34 69.02,67.84 69.02,66.84 72.02,63.84 73.77,63.84 U1.86
  Bottom 0.152: v72.4,80.97 82.9,80.97 89.52,87.59 JP2.7
87  (via drill 0.66)
  Top 0.152: v83.27,76.72 83.27,83.97 86.9,87.59 JP2.6
  Bottom 0.152: v83.27,76.72 U1.87
88  (via drill 0.66)
  Top 0.152: v74.4,83.59 73.27,82.47 73.27,69.72 73.4,69.59 73.4,68.59 72.15,67.34 72.15,65.59 U1.88
  Bottom 0.152: v74.4,83.59 80.4,83.59 84.4,87.59 JP2.5
90  (via drill 0.66)
  Top 0.152: v81.02,76.22 81.02,86.72 81.9,87.59 JP2.4
  Bottom 0.152: v81.02,76.22 72.15,67.34 70.4,67.34 U1.90
91  (via drill 0.66)
  Top 0.152: v74.52,84.97 70.4,80.84 70.4,70.97 U1.91
  Bottom 0.152: v74.52,84.97 76.65,84.97 79.27,87.59 JP2.3
92  (via drill 0.66)
  Top 0.152: v76.4,75.22 76.4,87.22 76.77,87.59 JP2.2
  Bottom 0.152: v76.4,75.22 70.4,69.22 68.52,69.22 U1.92
93
  Top 0.152: JP2.1 74.27,87.59 68.52,81.84 68.52,72.84 U1.93
96
  Top 0.152: JP4.8 92.02,95.97 90.15,97.84 78.02,97.84 78.02,93.72 66.15,81.84 66.15,75.72 65.02,74.59 65.02,72.84 U1.96
97  (via drill 0.66)
  Top 0.152: v67.27,84.22 65.02,81.97 65.02,76.34 U1.97
  Bottom 0.152: v67.27,84.22 72.65,89.59 83.27,89.59 89.52,95.84 JP4.7
98  (via drill 0.66)
  Top 0.152: v77.4,79.59 80.52,82.72 80.52,89.47 86.9,95.84 JP4.6
  Bottom 0.152: v77.4,79.59 73.65,75.84 66.27,75.84 65.02,74.59 63.15,74.59 U1.98
99
  Bottom 0.152: JP4.5 84.52,95.97 86.4,97.84 89.9,97.84 90.65,97.09 90.65,80.47 74.77,80.47 72.52,78.22 63.15,78.22 U1.99
100  (via drill 0.66)
  Top 0.152: v75.4,79.59 75.4,89.34 81.9,95.84 JP4.4
  Bottom 0.152: v75.4,79.59 73.4,77.59 64.4,77.59 63.15,76.34 61.4,76.34 U1.100
101  (via drill 0.66)
  Top 0.152: v69.77,90.09 61.4,81.72 61.4,79.97 U1.101
  Bottom 0.152: v69.77,90.09 73.52,90.09 79.27,95.84 JP4.3
102
  Top 0.152: JP4.2 76.77,95.84 62.65,81.72 62.65,79.47 61.4,78.22 59.52,78.22 U1.102
103
  Top 0.152: JP4.1 74.27,95.84 66.52,88.09 62.15,88.09 62.15,93.84 61.4,94.59 59.52,94.59 U1.103
121  (via drill 0.66)
  Top 0.152: v38.77,84.34 38.02,83.59 38.02,74.59 U1.121
  Bottom 0.152: v38.77,84.34 45.02,84.34 50.15,89.47 LED4.A
122
  Top 0.152: LED3.A 45.65,89.47 40.27,84.09 40.27,77.59 41.02,76.84 41.02,75.72 39.77,74.47 39.77,72.84 U1.122
131  (via drill 0.66)
  Top 0.152: v26.9,90.47 22.02,85.59 22.02,79.22 23.77,77.47 23.77,70.72 28.9,65.59 U1.131
  Bottom 0.152: v26.9,90.47 32.02,90.47 34.02,88.47 40.27,88.47 41.27,89.47 LED2.A
132
  Top 0.152: LED1.A 36.77,89.47 33.15,85.84 33.15,70.34 33.9,69.59 33.9,68.59 33.15,67.84 33.15,66.72 33.9,65.97 33.9,65.09 32.65,63.84 30.9,63.84 U1.132
133
  Bottom 0.152: DZ1.10 12.77,65.34 14.27,63.84 27.15,63.84 U1.133
134
  Bottom 0.152: DZ1.9 12.65,62.97 11.02,64.59 11.02,66.47 26.27,66.47 28.9,63.84 28.9,61.97 U1.134
136
  Bottom 0.152: DZ1.8 12.77,60.22 13.4,59.59 22.4,59.59 23.15,58.84 24.15,58.84 25.4,60.09 27.15,60.09 U1.136
137
  Top 0.152: DZ1.7 12.77,57.84 17.27,57.84 19.52,60.09 23.52,60.09 U1.137
138
  Bottom 0.152: DZ1.6 12.77,55.34 15.27,57.84 20.52,57.84 21.27,57.09 22.4,57.09 23.65,58.34 25.27,58.34 U1.138
139
  Top 0.152: DZ1.5 12.77,52.72 18.4,58.34 21.77,58.34 U1.139
140
  Bottom 0.152: DZ1.4 12.77,50.22 16.02,53.47 18.77,53.47 21.77,56.47 23.52,56.47 U1.140
141
  Top 0.152: DZ1.3 12.77,47.72 15.15,50.09 15.15,53.47 18.15,56.47 19.9,56.47 U1.141
142
  Top 0.152: DZ1.2 12.65,45.09 11.02,46.72 11.02,50.59 12.02,51.59 14.65,51.59 14.65,53.59 18.9,57.84 20.52,57.84 21.77,56.59 21.77,54.84 U1.142
143  (via drill 0.66)
  Top 0.152: v17.15,45.22 16.9,45.47 16.9,50.22 18.15,51.47 18.15,54.72 U1.143
  Bottom 0.152: v17.15,45.22 15.27,43.34 13.52,43.34 12.77,42.59 DZ1.1
+3V3  (via drill 0.66)
  Top 0.152: v16.52,19.72 13.4,16.59 IC2.2 | R11.1 3.15,34.84 3.15,32.47 R12.1 3.27,32.34 3.27,27.84 3.77,27.34 R13.1 | QG2.4 51.4,57.22 45.15,63.47 45.15,65.34 C22.1 45.02,65.47 43.9,66.59 43.9,69.34 | 43.9,69.34 43.9,70.97 44.65,71.72 44.65,76.84 43.9,77.59 43.9,79.34 43.4,79.84 U1.115 | C24.1 36.9,39.97 39.27,37.59 39.27,30.97 38.02,29.72 38.02,27.84 U1.24 | C18.1 54.9,27.59 54.9,25.72 52.77,23.59 C17.1 | v71.52,8.97 70.4,10.09 70.4,27.72 68.52,29.59 U1.51 68.4,29.59 65.02,29.59 U1.50 65.02,29.72 65.02,37.09 67.9,39.97 C25.1 68.02,40.09 79.27,51.34 79.9,51.34 C26.1 80.02,51.47 82.77,54.22 82.77,54.72 U1.76 | S1.1 97.15,61.72 97.15,64.09 S1.2 97.15,64.22 97.15,66.59 S1.3 97.15,66.72 97.15,69.22 | 97.15,69.22 97.15,71.72 S1.5 97.15,71.84 97.15,74.22 S1.6 97.15,74.34 97.15,76.72 S1.7 97.15,76.84 97.15,79.34 S1.8 | 97.15,69.22 S1.4 | C19.1 67.9,58.47 59.15,67.22 59.15,70.47 C20.1 | JP3.1 55.77,92.59 52.9,89.72 52.9,79.59 53.27,79.22 53.27,74.84 52.15,73.72 C21.1 52.02,73.59 52.02,69.34 43.9,69.34
  Bottom 0.152: C14.+ 21.52,20.22 17.02,20.22 v16.52,19.72 9.02,27.22 3.9,27.22 R13.1 | R11.1 3.27,34.97 4.4,36.09 14.65,36.09 15.77,34.97 JTAG.4 15.9,34.97 20.02,39.09 25.9,39.09 28.52,41.72 36.9,41.72 | U1.144 20.02,52.97 24.52,52.97 26.02,51.47 C15.1 26.15,51.47 34.9,60.22 35.02,60.22 | 35.02,60.22 32.65,62.59 32.65,65.47 U1.130 | 35.02,60.22 36.77,58.47 C23.1 36.9,58.34 38.02,58.34 | 36.9,41.72 36.9,43.97 37.4,43.97 38.02,44.59 38.02,58.34 | 36.9,41.72 36.9,40.09 C24.1 | 38.02,58.34 C22.1 | C25.1 68.02,39.97 71.15,36.84 72.02,36.84 U1.58 | C16.1 45.15,32.34 59.65,32.34 C18.1 59.77,32.34 62.27,32.34 64.9,29.72 U1.50 | v71.52,8.97 72.27,8.97 72.27,4.47 ST1.B7 | U1.76 82.9,54.72 86.4,54.72 U1.73 86.52,54.84 93.27,61.59 97.15,61.59 S1.1 | U1.123 36.27,72.84 36.65,73.22 38.52,73.22 39.27,73.97 40.27,73.97 41.02,73.22 51.65,73.22 52.02,73.59 C21.1 52.15,73.59 56.02,73.59 59.02,70.59 C20.1 59.15,70.59 61.02,70.59 64.4,73.97 66.15,73.97 66.65,74.47 U1.95 | C26.1 79.9,51.47 73.02,58.34 68.02,58.34 C19.1
+5V  (via drill 0.66)
  Top 0.152: 76.4,30.09 76.15,30.34 76.15,31.22 75.65,31.72 U$2.32 | 76.4,30.09 78.02,30.09 78.02,31.72 U$2.30 | 76.4,30.09 75.65,29.34 75.65,28.59 74.9,27.84 74.9,12.59 | 74.9,12.59 74.9,10.72 v76.65,8.97 | v15.77,8.59 15.77,16.47 IC2.3 | v42.9,15.84 42.9,20.22 44.65,21.97 44.65,22.97 43.9,23.72 43.9,24.72 44.65,25.47 44.65,26.47 43.9,27.22 43.9,56.59 46.27,58.97 QG1.14 | v74.65,12.59 74.9,12.59
  Bottom 0.152: v76.65,8.97 77.52,8.09 80.9,8.09 82.52,6.47 82.52,4.47 ST1.B3 | ST1.B29 16.4,4.47 15.77,4.47 v15.77,8.59 22.65,15.47 | 22.65,15.47 32.52,15.47 33.15,14.84 41.9,14.84 v42.9,15.84 46.15,12.59 v74.65,12.59 | 22.65,15.47 3.15,15.47 3.15,18.97 4.4,20.22 C13.+
A0  (via drill 0.66)
  Top 0.152: v9.65,48.84 9.65,8.59 11.4,6.84 11.4,4.47 ST1.A31
  Bottom 0.152: v9.65,48.84 19.4,48.84 19.9,49.34 U1.1
A1  (via drill 0.66)
  Top 0.152: v12.27,9.72 13.9,8.09 13.9,4.47 ST1.A30
  Bottom 0.152: v12.27,9.72 2.15,9.72 2.15,37.84 2.77,38.47 3.15,38.47 8.52,43.84 14.52,43.84 18.15,47.47 U1.2
A2
  Top 0.152: U1.5 23.52,45.72 21.27,45.72 21.27,45.22 17.4,41.34 17.4,8.76 16.51,6.99 ST1.A29
A3
  Top 0.152: U1.6 21.77,43.97 19.15,41.34 19.15,4.47 ST1.A28
A4
  Top 0.152: ST1.A27 21.59,7.57 20.27,8.89 20.27,40.59 23.02,43.34 23.02,43.97 25.27,43.97 U1.7
A5
  Top 0.152: U1.8 23.52,42.09 23.27,41.84 23.27,5.22 24.02,4.47 ST1.A26
A6  (via drill 0.66)
  Top 0.152: v29.15,10.97 29.15,22.59 27.65,24.09 27.65,37.22 28.52,38.09 28.52,39.09 27.65,39.97 27.65,41.72 27.27,42.09 U1.9 | v27.02,10.22 26.77,9.97 26.77,4.47 ST1.A25
  Bottom 0.152: v29.15,10.97 28.4,10.22 v27.02,10.22
A7  (via drill 0.66)
  Top 0.152: v25.02,10.97 25.02,40.09 25.27,40.34 U1.10 | v28.9,9.22 29.15,8.97 29.15,4.47 ST1.A24
  Bottom 0.152: v25.02,10.97 26.77,9.22 v28.9,9.22
A8  (via drill 0.66)
  Top 0.152: v24.15,21.84 24.15,40.97 26.65,43.47 27.65,43.47 28.52,42.59 28.52,40.84 28.9,40.47 U1.11 | v31.27,16.34 31.27,4.84 31.65,4.47 ST1.A23
  Bottom 0.152: v24.15,21.84 29.65,16.34 v31.27,16.34
A9  (via drill 0.66)
  Top 0.152: v25.9,22.72 25.9,37.34 27.15,38.59 U1.12 | v33.9,16.97 34.27,16.59 34.27,4.47 ST1.A22
  Bottom 0.152: v25.9,22.72 27.77,20.84 30.9,20.84 31.9,19.84 31.9,16.97 v33.9,16.97
A10  (via drill 0.66)
  Top 0.152: v29.52,26.34 29.52,36.22 29.02,36.72 U1.14 | v36.77,17.47 36.77,4.47 ST1.A21
  Bottom 0.152: v29.52,26.34 32.52,23.34 36.02,23.34 36.77,22.59 v36.77,17.47
A11  (via drill 0.66)
  Top 0.152: v26.77,14.59 v26.77,32.84 | v39.15,9.22 39.27,9.09 39.27,4.47 ST1.A20
  Bottom 0.152: v26.77,32.84 30.27,36.34 32.15,36.34 32.52,36.72 U1.15 | v26.77,14.59 32.15,9.22 v39.15,9.22
A12  (via drill 0.66)
  Top 0.152: v32.15,14.59 32.15,16.72 31.9,16.97 31.9,22.47 31.27,23.09 31.27,34.59 30.9,34.97 U1.16 | v41.27,10.09 41.9,9.47 41.9,4.47 ST1.A19
  Bottom 0.152: v32.15,14.59 36.65,10.09 v41.27,10.09
A13  (via drill 0.66)
  Top 0.152: v34.4,18.59 34.4,22.47 33.15,23.72 33.15,32.59 32.65,33.09 U1.18 | v41.27,15.72 44.4,12.59 44.4,4.47 ST1.A18
  Bottom 0.152: v34.4,18.59 37.27,15.72 v41.27,15.72
A14  (via drill 0.66)
  Top 0.152: v46.15,33.47 46.4,33.22 46.4,23.72 45.65,22.97 45.65,21.97 46.4,21.22 46.4,20.09 45.65,19.34 45.65,8.89 46.99,7.55 ST1.A17
  Bottom 0.152: v46.15,33.47 36.52,33.47 36.27,33.22 U1.19
A15  (via drill 0.66)
  Top 0.152: v39.52,13.97 39.52,22.47 36.65,25.34 36.65,28.34 37.4,29.09 37.4,30.84 37.9,31.34 U1.21 | v46.77,9.22 49.52,6.47 49.52,4.47 ST1.A16
  Bottom 0.152: v39.52,13.97 44.27,9.22 v46.77,9.22
AA0  (via drill 0.66)
  Top 0.152: v89.4,16.72 89.4,18.84 89.52,18.97 U$2.12 | v55.02,14.47 54.15,15.34 54.15,18.84 U1.38
  Bottom 0.152: v89.4,16.72 87.9,15.22 57.77,15.22 57.02,14.47 v55.02,14.47
AA1  (via drill 0.66)
  Top 0.152: v88.02,16.97 88.02,18.84 88.15,18.97 U$2.11
  Bottom 0.152: v88.02,16.97 86.15,18.84 57.77,18.84 U1.39
AA2  (via drill 0.66)
  Top 0.152: v86.65,16.97 86.65,18.72 86.9,18.97 U$2.10 | v58.65,16.09 56.02,18.72 56.02,20.59 U1.40
  Bottom 0.152: v86.65,16.97 85.77,16.09 v58.65,16.09
AA3  (via drill 0.66)
  Top 0.152: v85.27,16.97 85.27,18.59 85.65,18.97 U$2.9 | v62.15,17.97 59.52,20.59 U1.41
  Bottom 0.152: v85.27,16.97 84.27,17.97 v62.15,17.97
AA4  (via drill 0.66)
  Top 0.152: v83.9,16.97 83.9,18.47 84.4,18.97 U$2.8
  Bottom 0.152: v83.9,16.97 83.77,17.09 57.65,17.09 56.4,18.34 56.4,19.34 57.65,20.59 57.65,22.34 U1.42
AA5  (via drill 0.66)
  Top 0.152: U$2.7 82.65,19.59 v82.65,21.09
  Bottom 0.152: v82.65,21.09 82.02,21.72 62.02,21.72 61.4,22.34 U1.43
AA6  (via drill 0.66)
  Top 0.152: v81.77,22.59 81.77,19.22 81.9,19.09 U$2.6
  Bottom 0.152: v81.77,22.59 82.4,21.97 83.02,21.97 83.52,21.47 83.52,20.22 65.4,20.22 64.4,21.22 60.77,21.22 59.52,22.47 59.52,24.22 U1.44
AA7  (via drill 0.66)
  Top 0.152: v80.27,24.34 80.27,19.47 80.65,19.09 U$2.5
  Bottom 0.152: v80.27,24.34 63.15,24.34 U1.45
AA8  (via drill 0.66)
  Top 0.152: v82.65,29.34 82.65,31.22 83.15,31.72 U$2.26
  Bottom 0.152: v82.65,29.34 80.4,27.09 69.27,27.09 67.27,29.09 66.15,29.09 63.15,26.09 61.4,26.09 U1.46
AA9  (via drill 0.66)
  Top 0.152: v81.52,26.09 81.52,31.34 81.9,31.72 U$2.27
  Bottom 0.152: v81.52,26.09 65.02,26.09 U1.47
AA10  (via drill 0.66)
  Top 0.152: v86.4,29.34 86.4,31.22 86.9,31.72 U$2.23 | v67.52,25.22 65.02,27.72 63.15,27.72 U1.48
  Bottom 0.152: v86.4,29.34 82.27,25.22 v67.52,25.22
AA11  (via drill 0.66)
  Top 0.152: v84.27,29.47 84.27,31.59 84.4,31.72 U$2.25
  Bottom 0.152: v84.27,29.47 81.77,26.97 81.15,26.97 80.77,26.59 67.9,26.59 66.77,27.72 U1.49
AA12  (via drill 0.66)
  Top 0.152: v79.4,28.72 79.4,19.09 U$2.4
  Bottom 0.152: v79.4,28.72 80.77,28.72 81.27,29.22 81.27,31.34 70.4,31.34 U1.53
AA13  (via drill 0.66)
  Top 0.152: v80.4,29.59 80.4,31.47 80.65,31.72 U$2.28
  Bottom 0.152: v80.4,29.59 79.9,30.09 69.77,30.09 68.52,31.34 68.52,33.09 U1.54
AA14  (via drill 0.66)
  Top 0.152: U$2.3 78.27,19.22 v78.27,27.97
  Bottom 0.152: v78.27,27.97 78.4,27.84 80.52,27.84 81.77,29.09 81.77,34.47 76.9,34.47 76.65,34.72 75.52,34.72 74.02,33.22 72.15,33.22 U1.55
AA15  (via drill 0.66)
  Top 0.152: v76.27,33.84 76.27,32.34 76.77,31.84 U$2.31
  Bottom 0.152: v76.27,33.84 74.4,31.97 71.52,31.97 70.4,33.09 70.4,34.97 U1.56
AA16  (via drill 0.66)
  Top 0.152: v76.27,27.97 76.27,19.59 76.77,19.09 U$2.2 | v74.77,29.22 74.9,29.34 74.9,34.09 78.77,37.97 78.77,39.09 78.02,39.84 76.9,39.84 75.77,38.72 73.9,38.72 U1.60
  Bottom 0.152: v76.27,27.97 75.02,29.22 v74.77,29.22
B1  (via drill 0.66)
  Top 0.152: v37.15,78.47 v35.4,76.72
  Bottom 0.152: R8.1 25.52,76.72 v35.4,76.72 | v37.15,78.47 37.4,78.22 41.52,78.22 U1.117
B2
  Bottom 0.152: R9.1 28.27,78.47 29.15,77.59 40.27,77.59 41.52,76.34 43.27,76.34 U1.118
B5
  Bottom 0.152: R7.1 21.27,78.72 21.52,78.97 27.27,78.97 27.9,79.59 41.9,79.59 43.27,78.22 45.15,78.22 U1.116
BLUE  (via drill 0.66)
  Top 0.152: R7.2 23.27,80.09 24.65,80.09 R8.2 | v19.02,80.72 19.02,84.84 18.77,85.09 X1.3
  Bottom 0.152: R9.2 26.4,80.22 26.27,80.09 24.77,80.09 R8.2 | v19.02,80.72 19.52,80.22 23.15,80.22 R7.2
D0  (via drill 0.66)
  Top 0.152: v55.77,27.22 56.4,26.59 56.4,21.97 59.9,18.47 59.9,13.34 65.15,8.09 67.27,8.09 67.27,4.47 ST1.A9
  Bottom 0.152: v55.77,27.22 53.27,29.72 48.65,29.72 47.52,30.84 39.15,30.84 38.4,30.09 36.65,30.09 36.27,29.72 U1.22
D1  (via drill 0.66)
  Top 0.152: v59.27,26.34 69.9,15.72 69.9,4.47 ST1.A8
  Bottom 0.152: v59.27,26.34 53.27,26.34 50.52,29.09 40.27,29.09 39.77,29.59 U1.23
D2  (via drill 0.66)
  Top 0.152: v42.02,17.97 42.02,22.84 42.9,23.72 42.9,24.72 42.02,25.59 42.02,27.34 41.65,27.72 U1.25 | v71.27,13.47 72.4,12.34 72.4,4.47 ST1.A7
  Bottom 0.152: v42.02,17.97 45.15,14.84 45.15,14.22 53.4,14.22 54.52,13.09 70.9,13.09 v71.27,13.47
D3  (via drill 0.66)
  Top 0.152: v51.4,25.97 51.65,25.72 51.65,23.09 55.4,19.34 55.4,18.34 54.65,17.59 54.65,16.09 v59.27,11.47 | v73.27,11.47 74.9,9.84 74.9,4.47 ST1.A6
  Bottom 0.152: v51.4,25.97 43.4,25.97 U1.27 | v73.27,11.47 v59.27,11.47
D4  (via drill 0.66)
  Top 0.152: v82.77,14.34 77.52,9.09 77.52,4.47 ST1.A5
  Bottom 0.152: v82.77,14.34 90.77,14.34 90.77,17.22 84.52,23.47 81.4,23.47 80.9,22.97 62.65,22.97 60.15,25.47 59.02,25.47 58.65,25.09 51.02,25.09 50.65,25.47 44.65,25.47 43.9,24.72 42.02,24.72 41.65,24.34 U1.28
D5  (via drill 0.66)
  Top 0.152: v61.4,10.59 v56.65,15.34 | v80.27,10.59 80.02,10.34 80.02,4.47 ST1.A4
  Bottom 0.152: v56.65,15.34 52.9,15.34 52.9,18.47 47.65,23.72 45.77,23.72 45.27,24.22 U1.29 | v80.27,10.59 v61.4,10.59
D6  (via drill 0.66)
  Top 0.152: v60.77,14.34 64.65,18.22 v64.65,19.72 | v89.65,15.34 82.65,8.34 82.65,4.47 ST1.A3
  Bottom 0.152: v60.77,14.34 60.02,13.59 54.65,13.59 53.52,14.72 45.65,14.72 45.65,19.34 46.4,20.09 46.4,21.22 45.65,21.97 43.77,21.97 43.4,22.34 U1.30 | v64.65,19.72 65.02,19.34 88.02,19.34 90.27,17.09 90.27,15.34 v89.65,15.34
D7  (via drill 0.66)
  Top 0.152: v56.77,34.97 49.4,27.59 49.4,24.84 47.02,22.47 U1.31 | v67.25,36.23 73.77,29.72 v73.77,13.59 | v84.15,8.59 85.02,7.72 85.02,4.47 ST1.A2
  Bottom 0.152: v67.25,36.23 58.04,36.23 v56.77,34.97 | v73.77,13.59 73.9,13.47 79.27,13.47 v84.15,8.59
G1
  Bottom 0.152: R5.1 15.9,75.59 17.65,77.34 17.9,77.34 18.52,77.97 18.52,79.34 17.65,80.22 17.65,82.97 45.65,82.97 46.9,81.72 48.65,81.72 U1.112
G2
  Bottom 0.152: R6.1 19.27,76.59 19.27,79.84 18.65,79.84 18.15,80.34 18.15,81.59 45.15,81.59 U1.113
G5
  Bottom 0.152: R4.1 12.52,76.59 12.52,83.47 46.9,83.47 U1.111
GCLK
  Top 0.152: QG2.3 56.65,57.22 61.52,57.22 61.52,58.97 QG1.8
  Bottom 0.152: U1.128 34.4,67.22 35.15,66.47 54.15,66.47 61.52,59.09 QG1.8
GND  (via drill 0.66)
  Top 0.508: v79.77,63.84 82.77,60.84 82.77,58.47 U1.77 | v74.27,81.97 74.15,81.84 74.15,75.72 75.52,74.34 75.52,65.72 75.65,65.59 U1.85 | v25.4,67.47 25.4,61.97 U1.135 | U1.124 37.9,70.84 37.9,64.59 36.9,63.59 C23.2 37.02,63.34 38.15,62.22 38.15,46.34 36.9,45.09 C24.2 | U1.114 46.9,79.84 46.77,79.72 46.77,72.22 45.15,70.59 C22.2 | 52.15,95.09 52.15,78.84 C21.2 | 52.15,95.09 50.27,96.97 R16.2 50.15,97.22 45.9,97.22 R15.2 45.65,97.22 41.52,97.22 R14.2 41.27,97.22 36.9,97.22 R17.2 36.65,97.09 35.27,97.09 23.27,85.09 X1.5 23.52,85.09 29.52,79.09 29.52,68.59 U1.129 | JP3.6 68.52,92.72 67.52,93.72 67.52,94.09 66.27,95.34 52.15,95.34 52.15,95.09 | JTAG.10 15.9,27.22 15.9,21.09 15.15,21.09 11.9,17.84 11.9,17.34 11.15,16.59 IC2.1 11.02,16.34 11.02,8.84 v11.15,8.72 | v10.77,39.59 10.77,37.47 R10.2 | v94.4,13.84 94.4,18.84 94.52,18.97 U$2.16 | C19.2 67.9,63.59 66.77,64.72 66.77,70.84 U1.94 | QG2.2 56.65,53.34 61.52,53.34 61.52,51.47 QG1.7 61.77,51.34 61.77,51.22 67.9,45.09 C25.2 67.4,45.34 59.77,37.72 C18.2 59.65,37.47 59.65,35.47 52.77,28.59 C17.2 52.52,28.47 52.15,28.47 50.15,26.47 50.15,22.09 48.77,20.72 U1.33 | U1.17 34.27,35.09 34.27,38.59 30.9,38.59 U1.13 31.15,38.84 31.15,51.34 C15.2 | v16.15,50.97 15.9,50.72 15.9,37.47 JTAG.2 | X1.10 21.77,87.72 20.27,87.72 X1.9 | X1.8 17.27,87.72 15.27,87.72 X1.7 14.77,87.72 13.27,87.72 X1.6 12.77,87.22 7.77,82.22 2.77,82.22 2.77,68.22 RN1.1
  Bottom 0.508: v79.77,63.84 78.27,65.34 75.9,65.34 75.77,65.47 U1.85 | 63.4,86.59 60.77,86.59 57.77,83.59 U1.105 | 63.4,86.59 68.52,86.59 68.52,92.59 JP3.6 | v74.27,81.97 73.27,82.97 66.77,82.97 63.4,86.34 63.4,86.59 | RN1.1 3.15,67.34 25.4,67.34 | 25.4,67.34 U1.129 | v25.4,67.47 25.4,67.34 | C21.2 52.02,78.84 51.02,79.84 47.02,79.84 U1.114 | C22.2 45.02,70.59 44.77,70.84 38.02,70.84 U1.124 | C13.- 4.52,17.84 21.52,17.84 C14.- 21.52,18.09 23.15,19.72 23.15,21.09 22.9,21.34 22.9,29.84 | v10.77,39.59 11.02,39.34 13.9,39.34 15.77,37.47 JTAG.2 | 22.9,29.84 15.9,29.84 JTAG.8 | 22.9,29.84 33.15,29.84 36.77,26.22 39.52,26.22 39.65,26.09 U1.26 | v11.15,8.72 11.4,8.72 11.4,4.47 ST1.B31 | U1.57 73.9,35.09 75.52,36.72 75.65,36.72 U1.59 75.9,36.72 76.27,36.34 82.9,36.34 89.4,29.84 | ST1.B1 87.65,4.47 87.65,7.09 v94.4,13.84 94.4,24.84 89.4,29.84 | 62.9,63.59 67.9,63.59 C19.2 | 62.9,63.59 60.9,63.59 59.15,65.34 C20.2 | 71.52,47.97 68.65,45.09 68.02,45.09 C25.2 | 71.52,47.97 73.77,50.22 | 73.77,50.22 74.9,51.34 C26.2 | U1.64 77.4,42.22 71.77,47.84 71.65,47.84 71.52,47.97 | 62.9,63.59 62.9,51.47 61.65,51.47 QG1.7 | 32.27,50.22 36.77,45.72 36.77,45.09 C24.2 | 32.27,50.22 31.15,51.34 C15.2 | 23.02,48.72 24.4,50.09 32.15,50.09 32.27,50.22 | 23.02,48.72 21.9,47.59 U1.3 | U1.17 34.4,35.09 42.65,35.09 45.02,37.47 C16.2 55.52,37.47 | 55.52,37.47 55.52,34.47 56.27,33.72 64.4,33.72 66.65,31.47 U1.52 | C18.2 55.52,37.47 | 89.4,29.84 97.4,37.84 97.4,50.97 81.4,50.97 80.52,50.09 73.9,50.09 73.77,50.22 | v16.15,50.97 20.77,50.97 23.02,48.72 | X1.8 17.77,87.72 19.77,87.72 X1.9
  pour Top: -1.9,100.33 100.97,100.33 100.97,8.26 -1.9,8.26
  pour Bottom: -1.27,102.23 100.97,102.23 100.97,8.26 -1.27,8.26
GREEN
  Top 0.152: X1.2 16.27,85.09 15.9,84.72 15.9,78.22 R5.2
  Bottom 0.152: R6.2 17.4,78.34 16.02,78.34 15.9,78.22 R5.2 15.77,78.22 14.4,78.22 14.27,78.34 R4.2
H-SYNC  (via drill 0.66)
  Top 0.152: v22.4,75.84 19.9,78.34 19.9,85.34 18.65,86.59 18.65,90.09 X1.13
  Bottom 0.152: v22.4,75.84 38.4,75.84 39.65,74.59 41.52,74.59 U1.120
IRQ
  Top 0.152: IRQ_SEL.8 35.65,22.22 38.02,22.22 IRQ_SEL.10
  Bottom 0.152: IRQ_SEL.2 28.02,22.22 30.4,22.22 IRQ_SEL.4 30.52,22.22 IRQ_SEL.6 | U1.32 45.15,20.72 44.65,21.22 39.15,21.22 38.15,22.22 IRQ_SEL.10 | IRQ_SEL.6 35.52,22.22 IRQ_SEL.8 | IRQ_SEL.6
IRQ2  (via drill 0.66)
  Top 0.152: v27.9,8.34 27.9,19.59 IRQ_SEL.1
  Bottom 0.152: v27.9,8.34 27.26,7.71 27.31,7.71 27.31,5.08 ST1.B25
IRQ3  (via drill 0.66)
  Top 0.152: v30.4,8.47 30.4,19.59 IRQ_SEL.3
  Bottom 0.152: v30.4,8.47 30.4,8.44 29.85,8.26 29.85,5.08 ST1.B24
IRQ4  (via drill 0.66)
  Top 0.152: v33.02,8.34 IRQ_SEL.5
  Bottom 0.152: v33.02,8.34 33.02,8.26 31.75,6.99 ST1.B23
IRQ5  (via drill 0.66)
  Top 0.152: v35.52,8.34 35.52,19.59 IRQ_SEL.7
  Bottom 0.152: v35.52,8.34 35.52,8.22 34.29,6.99 ST1.B22
IRQ6  (via drill 0.66)
  Top 0.152: v38.15,8.34 38.15,19.59 IRQ_SEL.9
  Bottom 0.152: v38.15,8.34 38.15,8.03 36.83,7.62 ST1.B21
N$5
  Top 0.152: LED2.K 41.27,92.09 41.27,94.59 R14.1
N$6
  Top 0.152: LED3.K 45.77,92.09 45.77,94.59 R15.1
N$7
  Top 0.152: LED4.K 50.15,92.09 50.15,94.59 R16.1
N$8
  Top 0.152: LED1.K 36.9,92.09 36.9,94.59 R17.1
N$23
  Top 0.152: RN1.11 2.65,42.59 5.02,42.59 DZ1.20
N$24
  Top 0.152: RN1.10 2.65,45.09 5.02,45.09 DZ1.19
N$25
  Top 0.152: RN1.9 2.65,47.59 5.02,47.59 DZ1.18
N$26
  Top 0.152: RN1.8 2.65,50.22 5.02,50.22 DZ1.17
N$27
  Top 0.152: RN1.7 2.65,52.72 5.02,52.72 DZ1.16
N$28
  Top 0.152: RN1.6 2.65,55.22 5.02,55.22 DZ1.15
N$29
  Top 0.152: RN1.5 2.65,57.84 5.02,57.84 DZ1.14
N$30
  Top 0.152: RN1.4 2.65,60.34 5.02,60.34 DZ1.13
N$31
  Top 0.152: RN1.3 2.65,62.84 5.02,62.84 DZ1.12
N$32
  Top 0.152: RN1.2 2.65,65.47 5.02,65.47 DZ1.11
NMI  (via drill 0.66)
  Top 0.152: v50.4,9.59 50.4,18.72 50.52,18.84 U1.35
  Bottom 0.152: v50.4,9.59 48.9,8.09 43.52,8.09 42.02,6.59 42.02,4.47 ST1.B19
PHI2  (via drill 0.66)
  Top 0.152: v34.9,26.34 34.9,30.09 37.4,32.59 37.4,33.97 35.65,35.72 35.65,67.84 34.9,68.59 34.9,70.34 34.4,70.84 U1.125 | v39.9,23.34 40.4,22.84 v40.4,8.47
  Bottom 0.152: v34.9,26.34 37.9,23.34 v39.9,23.34 | v40.4,8.47 40.4,8.44 39.37,7.62 ST1.B20
R1
  Bottom 0.152: R2.1 7.65,78.22 9.27,79.84 9.65,79.84 10.65,80.84 10.65,93.09 50.65,93.09 51.77,91.97 51.77,82.22 50.02,82.22 48.77,83.47 48.77,85.22 U1.109
R2
  Bottom 0.152: R3.1 11.15,79.22 11.15,86.34 28.27,86.34 29.77,84.84 38.02,84.84 43.77,90.59 50.52,90.59 51.27,89.84 51.27,83.59 50.65,83.59 U1.110
R5
  Bottom 0.152: R1.1 4.27,79.22 4.27,84.84 7.02,84.84 10.15,87.97 10.15,93.59 50.77,93.59 54.02,90.34 54.02,83.59 U1.108
R_CS  (via drill 0.66)
  Top 0.152: v87.65,44.84 87.65,32.34 88.15,31.84 U$2.22
  Bottom 0.152: v87.65,44.84 86.15,46.34 85.9,46.34 84.77,47.47 82.9,47.47 U1.70
R_R
  Top 0.152: U$2.24 85.77,31.84 86.27,32.34 86.27,47.34 86.4,47.47 U1.71
R_W
  Top 0.152: U$2.29 79.4,31.84 79.9,32.34 79.9,33.09 81.02,34.22 84.15,34.22 84.15,44.47 83.4,45.22 83.4,46.34 84.27,47.22 84.27,48.97 84.65,49.34 U1.72
RD0  (via drill 0.66)
  Top 0.152: v95.27,37.47 95.27,30.34 91.02,26.09 91.02,19.22 90.9,19.09 U$2.13
  Bottom 0.152: v95.27,37.47 94.15,38.59 77.52,38.59 U1.61
RD1  (via drill 0.66)
  Top 0.152: v91.9,25.59 91.9,19.22 92.02,19.09 U$2.14 | v82.4,35.09 82.4,42.72 79.9,45.22 75.77,45.22 75.77,40.47 U1.62
  Bottom 0.152: v82.4,35.09 v91.9,25.59
RD2  (via drill 0.66)
  Top 0.152: v96.15,38.47 96.15,30.59 93.77,28.22 93.77,19.47 93.4,19.09 U$2.15
  Bottom 0.152: v96.15,38.47 94.4,40.22 79.52,40.22 79.4,40.34 U1.63
RD3  (via drill 0.66)
  Top 0.152: v94.02,41.09 94.02,32.34 94.52,31.84 U$2.17
  Bottom 0.152: v94.02,41.09 93.02,42.09 81.15,42.09 U1.65
RD4  (via drill 0.66)
  Top 0.152: v92.77,42.97 92.77,32.34 93.27,31.84 U$2.18
  Bottom 0.152: v92.77,42.97 92.52,42.72 82.4,42.72 81.15,43.97 79.4,43.97 U1.66
RD5  (via drill 0.66)
  Top 0.152: v91.52,43.59 91.52,32.34 92.02,31.84 U$2.19
  Bottom 0.152: v91.52,43.59 91.15,43.97 82.9,43.97 U1.67
RD6
  Top 0.152: U$2.20 90.77,31.84 90.27,32.34 90.27,46.22 85.77,50.72 81.15,50.72 81.15,45.84 U1.68
RD7
  Top 0.152: U$2.21 89.52,31.84 89.02,32.34 89.02,46.84 87.02,48.84 85.9,48.84 84.77,47.72 84.77,45.84 U1.69
RED
  Top 0.152: X1.1 14.02,85.09 9.9,80.97 9.27,80.97 R3.2
  Bottom 0.152: R3.2 9.15,80.84 7.77,80.84 7.65,80.72 R2.2 7.52,80.72 6.15,80.72 6.02,80.84 R1.2
RESET  (via drill 0.66)
  Top 0.152: v47.52,11.72 47.52,18.34 47.02,18.84 U1.34
  Bottom 0.152: v47.52,11.72 48.77,10.47 56.52,10.47 58.15,8.84 70.15,8.84 71.15,9.84 79.77,9.84 81.52,8.09 83.4,8.09 85.02,6.47 85.02,4.47 ST1.B2
RW  (via drill 0.66)
  Top 0.152: v58.52,9.72 v52.02,16.22 | v69.02,13.97 v64.77,9.72 | v85.52,8.59 87.52,6.59 87.52,4.47 ST1.A1
  Bottom 0.152: v52.02,16.22 49.52,16.22 48.77,16.97 U1.36 | v64.77,9.72 v58.52,9.72 | v69.02,13.97 69.52,14.47 79.65,14.47 v85.52,8.59
RX
  Top 0.152: JP3.2 58.4,92.59 56.02,90.22 56.02,85.34 U1.107
TCK  (via drill 0.66)
  Top 0.152: v22.4,70.47 13.27,61.34 10.52,61.34 10.52,41.34 13.27,38.59 13.27,37.47 JTAG.1
  Bottom 0.152: R10.1 3.27,37.47 4.4,38.59 12.15,38.59 13.27,37.47 JTAG.1 | v22.4,70.47 33.02,70.47 35.65,67.84 69.02,67.84 69.77,68.59 71.52,68.59 72.02,69.09 U1.89
TDI  (via drill 0.66)
  Top 0.152: R13.2 11.52,27.34 13.27,27.34 JTAG.9 13.4,27.34 14.65,28.59 v14.65,40.47
  Bottom 0.152: v14.65,40.47 19.9,45.72 U1.4
TDO  (via drill 0.66)
  Top 0.152: R11.2 10.9,34.97 13.27,34.97 JTAG.3 | v48.15,31.47 53.77,37.09 53.77,75.97 57.65,79.84 U1.104
  Bottom 0.152: v48.15,31.47 48.02,31.34 39.77,31.34 38.4,32.72 37.52,32.72 36.77,31.97 35.65,31.97 34.9,32.72 33.9,32.72 33.15,31.97 18.02,31.97 16.27,33.72 14.52,33.72 13.4,34.84 JTAG.3
TMS
  Top 0.152: R12.2 10.9,32.34 13.27,32.34 JTAG.5
  Bottom 0.152: U1.20 34.27,31.34 34.02,31.09 14.65,31.09 13.4,32.34 JTAG.5
TX
  Bottom 0.152: JP3.3 60.9,92.59 54.65,86.34 54.65,84.72 55.9,83.47 55.9,81.72 U1.106
V-SYNC  (via drill 0.66)
  Top 0.152: v37.9,90.59 39.65,88.84 39.65,76.34 U1.119
  Bottom 0.152: v37.9,90.59 36.9,90.59 36.15,91.34 22.15,91.34 21.02,90.22 X1.14

### Text on the board
tValues: 107 | 106 | 99 | 98 | 97 | 96 | 103 | 102 | 101 | 100 | 132 | 131 | 122 | 121 | 93 | 92 | 91 | 90 | 88 | 87 | 86 | 84 | 83 | 82 | 81 | R | B | 80 | G | 79 | 78 | 133 | 75 | 134 | 74 | 136 | 137 | 138 | 139 | 140 | 141 | 142 | 143 | SRAM | CPLD_EPM3/7 | 10 | IRQ2 | IRQ3 | IRQ4 | IRQ5 | IRQ6